# EAGLE design vertical driver v8.7 (EAGLE 5.01)
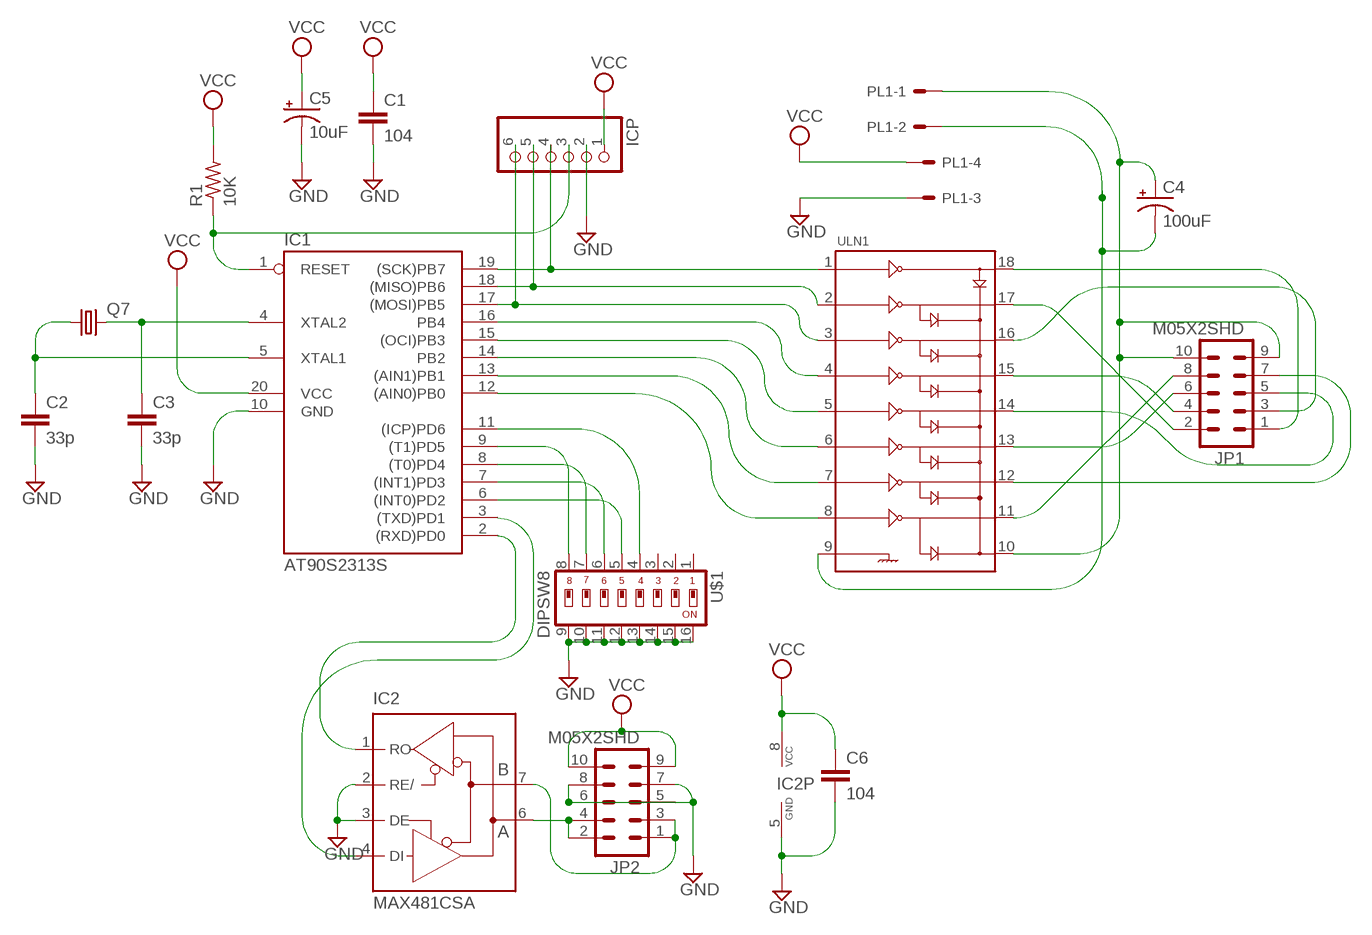
[diagram p0: schematic, sheet 1]

## Parts
C1  104  C-EUC3216  [C3216]
C2  33p  C-EUC3216  [C3216]
C3  33p  C-EUC3216  [C3216]
C4  100uF  CPOL-US153CLV-0807  [153CLV-0807]
C5  10uF  CPOL-US153CLV-0605  [153CLV-0605]
C6  104  C-EUC3216  [C3216]
IC1  AT90S2313S  [SO20L]
IC2  MAX481CSA  [SO08]
ICP  PINHD-1X6  [1X06]
JP1  M05X2SHD  [2X5-SHROUDED]
JP2  M05X2SHD  [2X5-SHROUDED]
PL1  555X-4H  [5569-4]
Q7  CRYSTALSMD  [HC49UP]
R1  10K  R-US_R3216  [R3216]
U$1  DIPSW8  [SO16-8W]
ULN1  ULN2803SOICW  [SO18L]

## Nets
GND: C1.2 C2.2 C3.2 C5.- C6.2 IC1.10(GND) IC2.2(RE/) IC2.3(DE) IC2.5(GND) ICP.2 JP2.5 JP2.6 JP2.7 JP2.8 PL1.3 U$1.9 U$1.10 U$1.11 U$1.12 U$1.13 U$1.14 U$1.15 U$1.16
N$1: IC1.17((MOSI)PB5) ICP.6 ULN1.3
N$2: IC2.7(B) JP2.1 JP2.3
N$3: IC2.6(A) JP2.2 JP2.4
N$4: IC1.1(RESET) ICP.3 R1.1
N$5: IC1.12((AIN0)PB0) ULN1.8
N$6: IC1.18((MISO)PB6) ICP.5 ULN1.2
N$7: IC1.13((AIN1)PB1) ULN1.7
N$8: IC1.14(PB2) ULN1.6
N$9: IC1.19((SCK)PB7) ICP.4 ULN1.1
N$10: IC1.15((OCI)PB3) ULN1.5
N$11: IC1.16(PB4) ULN1.4
N$12: JP1.1 ULN1.18
N$13: JP1.2 ULN1.17
N$14: JP1.3 ULN1.16
N$15: JP1.4 ULN1.15
N$16: JP1.5 ULN1.14
N$17: JP1.6 ULN1.13
N$18: JP1.7 ULN1.12
N$19: JP1.8 ULN1.11
N$20: C3.1 IC1.4(XTAL2) Q7.2
N$21: C2.1 IC1.5(XTAL1) Q7.1
N$22: IC1.2((RXD)PD0) IC2.1(RO)
N$23: IC1.3((TXD)PD1) IC2.4(DI)
N$25: C4.- PL1.2 ULN1.9
N$27: C4.+ JP1.9 JP1.10 PL1.1 ULN1.10
N$29: IC1.9((T1)PD5) U$1.8
N$30: IC1.8((T0)PD4) U$1.7
N$31: IC1.7((INT1)PD3) U$1.6
N$32: IC1.6((INT0)PD2) U$1.5
N$33: IC1.11((ICP)PD6) U$1.4
VCC: C1.1 C5.+ C6.1 IC1.20(VCC) IC2.8(VCC) ICP.1 JP2.9 JP2.10 PL1.4 R1.2
Unconnected: U$1.1 U$1.2 U$1.3

## Library data of the parts
C1-C3 C6 = resistor:C-EU: CAPACITOR, European symbol
C4 C5 = rcl:CPOL-US: POLARIZED CAPACITOR, American symbol
IC1 = atmel:AT90S2313: MICROCONTROLLER 2 Kbytes FLASH 128 bytes SRAM 128 bytes EEPROM UART
IC2 = maxim:MAX481CSA: RS485 TRANSEIVER
ICP = pinhead:PINHD-1X6: PIN HEADER
JP1 JP2 = SparkFun:M05X2: Header 5x2 Standard 10-pin dual row 0.1" header. Commonly used with AVR-ISP. Use with Spark Fun Electronics SKU: PRT-00778
PL1 = con-molex-2:555X-4: Mini FIT connector 4 way
Q7 = SparkFun:CRYSTAL: Crystals Various standard crystals. Proven footprints. Spark Fun Electronics SKU : COM-00534
R1 = resistor:R-US_: RESISTOR, American symbol
U$1 = otax:DIPSW8
ULN1 = SparkFun:ULN2803: Darlington Driver ULN2803 Darlington array. 500mA max per channel, 8-channel package. Spark Fun Electronics SKU : COM-00312

## Board
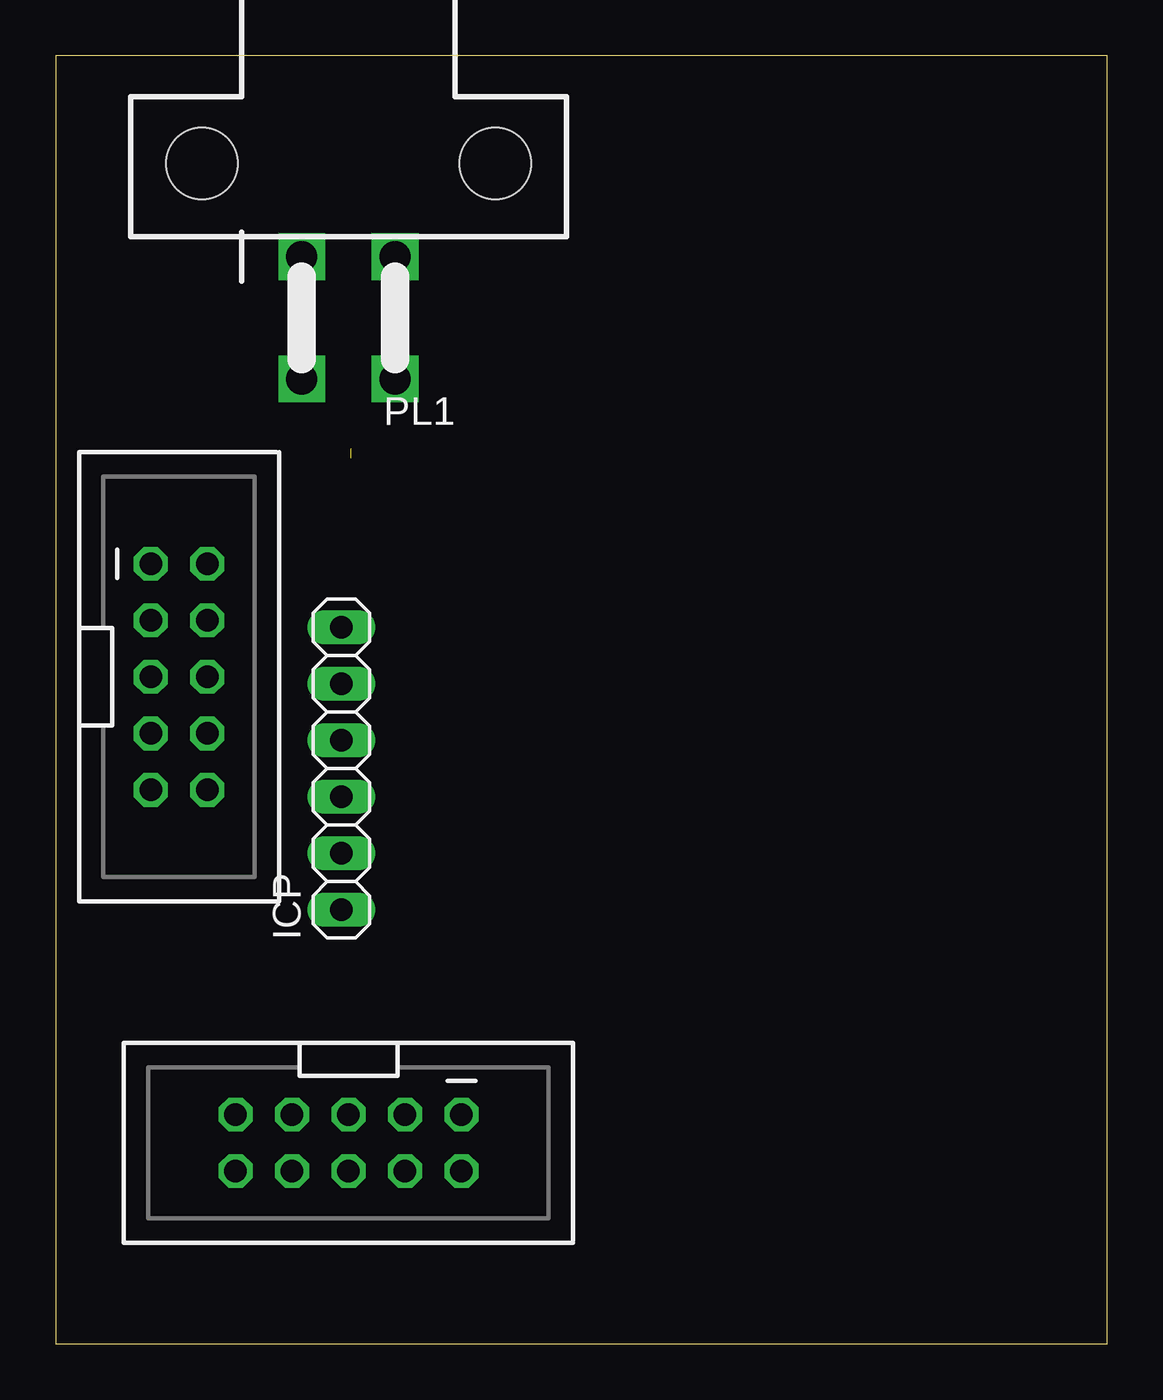
[diagram p1: board, top side]
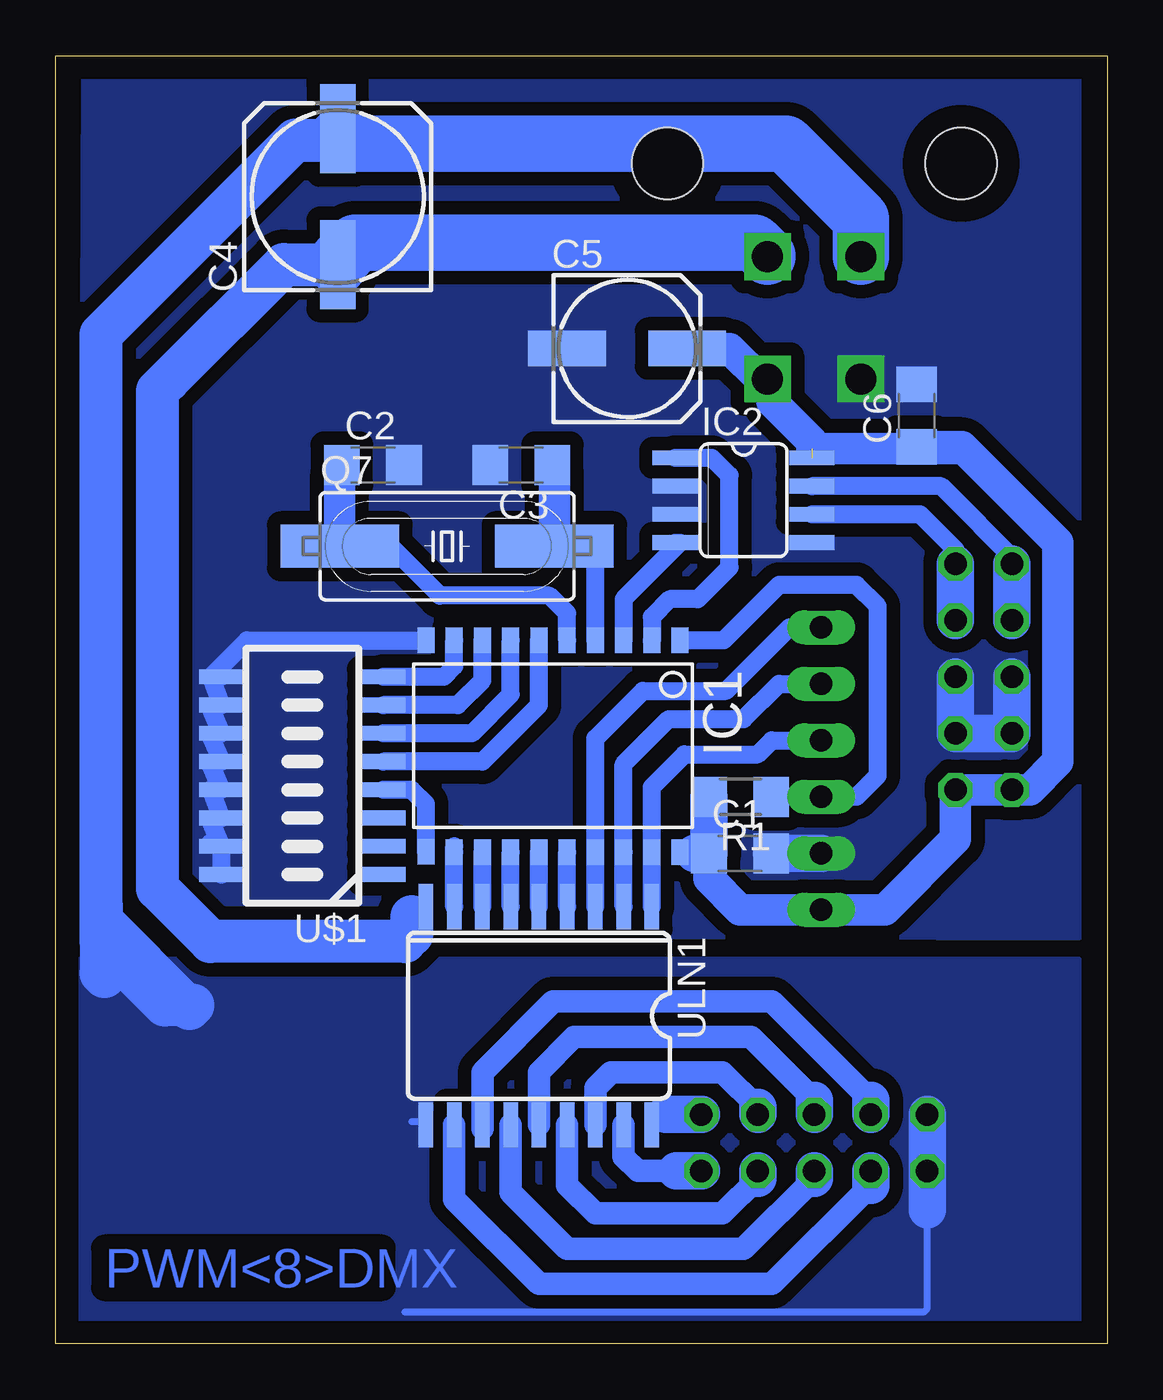
[diagram p2: board, bottom side, seen from below]

Size 47.29 x 57.93 mm. Coordinates in mm from the lower left corner, seen from the top.
Outline: 0,0 47.29,0 47.29,57.93 0,57.93 0,0
Copper layers (1*16): Top 0.035mm / dielectric 1.5mm / Bottom 0.035mm
Design rules "default": minimum track width 10mil, minimum drill 24mil, track to track 8mil, track to pad 8mil, pad to pad 8mil, via to via 8mil, smd to smd 8mil, copper to edge 40mil, drill to drill 8mil, minimum pad ring 10mil, minimum via ring 8mil, stop-mask expansion 4mil, vias tented up to drill 0mil, thermal gap 10mil

### Footprints (pad centres in the part's own frame; a part is rotated, then mirrored left to right if it is on the bottom)
C3216 = smd 1.6 x 1.8: 1 -1.4,0; 2 1.4,0
153CLV-0807 = smd 4 x 1.6: + 3.05,0; - -3.05,0
153CLV-0605 = smd 3.5 x 1.6: + 2.7,0; - -2.7,0
SO20L = smd 0.762 x 1.143: 1 -5.08,-5.131; 2 -3.81,-5.131; 3 -2.54,-5.131; 4 -1.27,-5.131; 5 0,-5.131; 6 1.27,-5.131; 7 2.54,-5.131; 8 3.81,-5.131; 9 5.08,-5.131; 10 6.35,-5.131; 11 6.35,4.369; 12 5.08,4.394; 13 3.81,4.394; 14 2.54,4.394; 15 1.27,4.394; 16 0,4.394; 17 -1.27,4.394; 18 -2.54,4.394; 19 -3.81,4.394; 20 -5.08,4.394
SO08 = smd 0.66 x 2.032: 1 -1.905,-3.073; 2 -0.635,-3.073; 3 0.635,-3.073; 4 1.905,-3.073; 5 1.905,3.073; 6 0.635,3.073; 7 -0.635,3.073; 8 -1.905,3.073
1X06 = drill 1.016 long: 1 -6.35,0; 2 -3.81,0; 3 -1.27,0; 4 1.27,0; 5 3.81,0; 6 6.35,0
2X5-SHROUDED = drill 1.016 octagon: 1 -1.27,5.08; 2 1.27,5.08; 3 -1.27,2.54; 4 1.27,2.54; 5 -1.27,0; 6 1.27,0; 7 -1.27,-2.54; 8 1.27,-2.54; 9 -1.27,-5.08; 10 1.27,-5.08
5569-4 = drill 1.4 square: 1 2.1,0; 2 -2.1,0; 3 2.1,5.5; 4 -2.1,5.5 | hole 3.2: 6.6,-4.2; -6.6,-4.2
HC49UP = smd 5.334 x 1.93: 1 -4.826,0; 2 4.826,0
R3216 = smd 1.6 x 1.8: 1 -1.4,0; 2 1.4,0
SO16-8W = smd 0.66 x 2.032: 1 0,0.813; 2 1.27,0.813; 3 2.54,0.813; 4 3.81,0.813; 5 5.08,0.813; 6 6.35,0.813; 7 7.62,0.813; 8 8.89,0.813; 9 8.89,8.077; 10 7.62,8.077; 11 6.35,8.077; 12 5.08,8.077; 13 3.81,8.077; 14 2.54,8.077; 15 1.27,8.077; 16 0,8.077
SO18L = smd 0.66 x 2.032: 1 -0.635,-4.902; 2 0.635,-4.902; 3 1.905,-4.902; 4 3.175,-4.902; 5 4.445,-4.902; 6 5.715,-4.902; 7 6.985,-4.902; 8 8.255,-4.902; 9 9.525,-4.902; 10 9.525,4.902; 11 8.255,4.902; 12 6.985,4.902; 13 5.715,4.902; 14 4.445,4.902; 15 3.175,4.902; 16 1.905,4.902; 17 0.635,4.902; 18 -0.635,4.902

### Placement (x,y rotation side)
C1  16.51,22.06 0 bottom
C2  33.02,39.52 0 bottom
C3  26.35,39.52 180 bottom
C4  34.6,51.59 90 bottom
C5  21.59,44.76 0 bottom
C6  8.57,41.74 90 bottom
IC1  24.28,26.51 180 bottom
IC2  16.35,37.93 270 bottom
ICP  12.85,25.87 90 top
JP1  13.17,9.04 270 top
JP2  5.55,30 0 top
PL1  13.17,48.89 180 top
Q7  29.68,35.87 0 bottom
R1  16.51,24.6 180 bottom
U$1  31.75,21.11 90 bottom
ULN1  21.11,14.76 180 bottom

### Tracks (layer width: path | path; a pad name or v marks a point on that pad's centre or on a via)
GND
  Bottom 0.813: ICP.2 14.12,22.06 | U$1.16 U$1.15 | U$1.15 40.3,22.52 40.32,22.54 | U$1.15 40.3,23.47 40.32,23.49 40.3,23.51 U$1.14 40.3,24.9 40.32,24.92 U$1.13 40.3,26.01 40.32,26.03 40.3,26.05 U$1.12 40.3,27.28 40.32,27.3 40.3,27.32 U$1.11 40.3,28.55 40.32,28.57 40.3,28.59 U$1.10 40.3,29.98 40.32,30 | 40.32,30 U$1.9 | IC1.10 38.68,31.64 40.32,30
  Bottom 1.676: JP2.5 JP2.7 JP2.8 JP2.6 | ICP.2 | ICP.2 C1.2 | ICP.2
  pour Bottom (isolate 0.61, no thermals): 1.27,57.14 1.27,18.25 46.19,18.41 46.03,57.14
N$1
  Bottom 0.813: ULN1.3 IC1.17 23.01,24.44 | 23.01,24.44 23.01,24.6 | ICP.6 14.28,32.22 17.14,29.36 20.88,29.36 23.01,27.23 23.01,24.44
N$2
  Bottom 0.61: JP2.1 4.12,34.92 4.28,34.76
  Bottom 0.813: 4.28,35.24 JP2.1 3.96,35.08 7.46,38.57 IC2.7
  Bottom 1.676: JP2.3 JP2.1
N$3
  Bottom 0.813: JP2.2 6.82,35.71 8.41,37.3 IC2.6
  Bottom 1.676: JP2.4 JP2.2
N$4
  Bottom 0.813: IC1.1 17.25,31.64 14.76,34.12 11.27,34.12 10.31,33.17 10.31,25.55 11.27,24.6 ICP.3 13.01,24.6 | 13.01,24.6 R1.1 | 13.01,24.6
N$5
  Bottom 0.813: 29.36,22.38 IC1.12 ULN1.8
N$6
  Bottom 0.813: ULN1.2 IC1.18 21.74,26.07 19.72,28.09 16.35,28.09 14.76,29.68 ICP.5
N$7
  Bottom 0.813: ULN1.7 IC1.13
N$8
  Bottom 0.813: ULN1.6 IC1.14
N$9
  Bottom 0.813: ULN1.1 20.47,22.06 | 20.47,22.06 IC1.19 | 20.47,22.06 20.47,23.17 | 20.47,23.17 20.47,23.33 | ICP.4 15.08,27.14 15.71,26.5 19.01,26.5 20.47,25.04 20.47,23.17
N$10
  Bottom 0.813: ULN1.5 IC1.15
N$11
  Bottom 0.813: ULN1.4 IC1.16
N$12
  Bottom 0.61: ULN1.18 20.3,9.85 19.84,10.31
  Bottom 1.676: JP1.1 19.84,10.31
N$13
  Bottom 1.016: ULN1.17 21.74,8.41 21.11,7.77 18.57,7.77
  Bottom 1.676: 18.57,7.77 JP1.2 18.57,7.77 | 18.57,7.77 19.36,7.77
N$14
  Bottom 1.016: ULN1.16 23.01,11.51 22.3,12.22 17.3,12.22 15.71,10.63
  Bottom 1.676: JP1.3 15.71,10.63
N$15
  Bottom 1.016: ULN1.15 24.28,7.14 23.01,5.87 17.3,5.87 15.71,7.45
  Bottom 1.676: JP1.4 15.71,7.45
N$16
  Bottom 1.016: ULN1.14 25.55,12.22 23.97,13.8 16.03,13.8 13.17,10.95
  Bottom 1.676: JP1.5 13.17,10.95
N$17
  Bottom 1.016: ULN1.13 26.82,6.82 24.28,4.28 16.35,4.28 13.17,7.45
  Bottom 1.676: JP1.6 13.17,7.45
N$18
  Bottom 1.016: 10.63,10.95 15.08,15.39 24.92,15.39 28.09,12.22 ULN1.12 28.09,9.68
  Bottom 1.676: JP1.7 10.63,10.95
N$19
  Bottom 1.016: ULN1.11 29.36,6.5 25.55,2.69 15.08,2.69 10.63,7.14
  Bottom 1.676: JP1.8 10.63,7.14
N$20
  Bottom 0.813: IC1.4 23.01,35.24 23.49,35.71 24.6,35.71 24.76,35.87 | 24.76,35.87 | 24.76,35.87 Q7.2
  Bottom 1.422: C3.1 24.95,39.23 24.86,39.14 Q7.2
N$21
  Bottom 0.813: IC1.5 24.28,32.85 25.08,33.65 30,33.65 32.22,35.87 34.44,35.87 Q7.1
  Bottom 1.422: C2.1 34.42,39.23 34.51,39.14 Q7.1
N$22
  Bottom 0.813: 20.47,31.58 IC1.2 20.47,32.7 19.68,33.49 18.41,33.49 16.98,34.92 16.98,39.05 17.78,39.84 IC2.1
N$23
  Bottom 0.813: IC2.4 19.2,36.03 21.74,33.49 IC1.3
N$25
  Bottom 0.305: ULN1.9 30.81,19.66 31.27,19.2
  Bottom 1.93: 34.6,49.21 34.6,48.57 C4.- 37.02,48.54 42.22,43.33 | 42.22,43.33 | 42.22,43.33 42.7,42.86 42.7,20.47 40.32,18.09 31.59,18.09 31.27,18.41 31.27,19.2
  Bottom 2.54: 34.6,48.41 | C4.- 34.6,48.41 | C4.- 34.6,48.73 34.44,48.89 | PL1.2 15.27,48.92 15.87,49.52 33.81,49.52 34.13,49.21 34.13,49.05 34.6,48.57 C4.-
N$27
  Bottom 0.305: ULN1.10 30.63,9.99 31.27,9.99 | JP1.9 8.09,1.58 8.25,1.42 31.59,1.42
  Bottom 1.676: JP1.9 JP1.10 8.09,6.03
  Bottom 1.93: 34.44,54.13 34.13,54.13 | 34.6,54.6 | 34.6,54.6 C4.+ | 34.44,54.13 34.44,54.44 34.6,54.6 | 41.27,15.07 45.24,19.04 45.24,19.84 | 45.24,19.84 45.24,45.4 36.51,54.13 34.6,54.13 34.44,54.13 | 45.08,16.5 | 45.08,16.5 45.24,16.66 45.24,19.84 | 45.24,19.84 45.24,18.09 42.38,15.23 41.11,15.23
  Bottom 2.54: 34.6,54.13 34.6,54.29 | PL1.1 11.07,50.6 14.44,53.97 34.13,53.97 34.13,54.13
  pour Bottom (isolate 0.61, no thermals): 1.27,17.3 1.27,0.79 46.19,0.79 46.19,17.3
N$29
  Bottom 0.813: U$1.8 29.84,30 29.36,30.47 IC1.9
N$30
  Bottom 0.813: U$1.7 29.21,28.73 28.09,29.84 IC1.8
N$31
  Bottom 0.813: U$1.6 28.57,27.46 26.82,29.2 IC1.7
N$32
  Bottom 0.813: U$1.5 28.09,26.19 25.55,28.73 IC1.6
N$33
  Bottom 0.61: IC1.11 30.63,22.06
  Bottom 0.813: U$1.4 31.27,24.92 30.63,24.28 IC1.11
VCC  (1 unrouted)
  Bottom 0.305: IC2.8 13.01,39.84 12.77,40.08
  Bottom 0.406: IC1.20 18.62,22.11 18.57,22.06 | 12.77,40.08
  Bottom 1.422: C1.1 17.91,20.92 16.51,19.52 12.7,19.52 | 12.7,19.52 | 12.7,19.52 ICP.1 10,19.52 6.82,22.69 JP2.10 4.44,24.92 | 4.44,24.92 | 19.68,44.76 C5.+ 16.98,44.76 15.55,43.33 15.5,43.39 PL1.4 15.43,43.45 15.39,43.49 15.08,43.17 15.08,42.38 13.27,40.58 13.27,40.26 6.5,40.26 | 6.5,40.26 6.45,40.26 2.22,36.03 2.22,26.19 3.49,24.92 4.44,24.92 | 4.44,24.92 | 4.44,24.92 JP2.9 | 6.5,40.26 6.5,40.32 6.53,40.34 C6.1
  Bottom 1.676: 18.57,22.06 C1.1 17.91,22.19 17.93,22.22 17.91,22.25 R1.2 | 18.57,22.06

### Text on the board
Bottom: PWM<8>DMX